# Altium project PDB_Board.PrjPcb
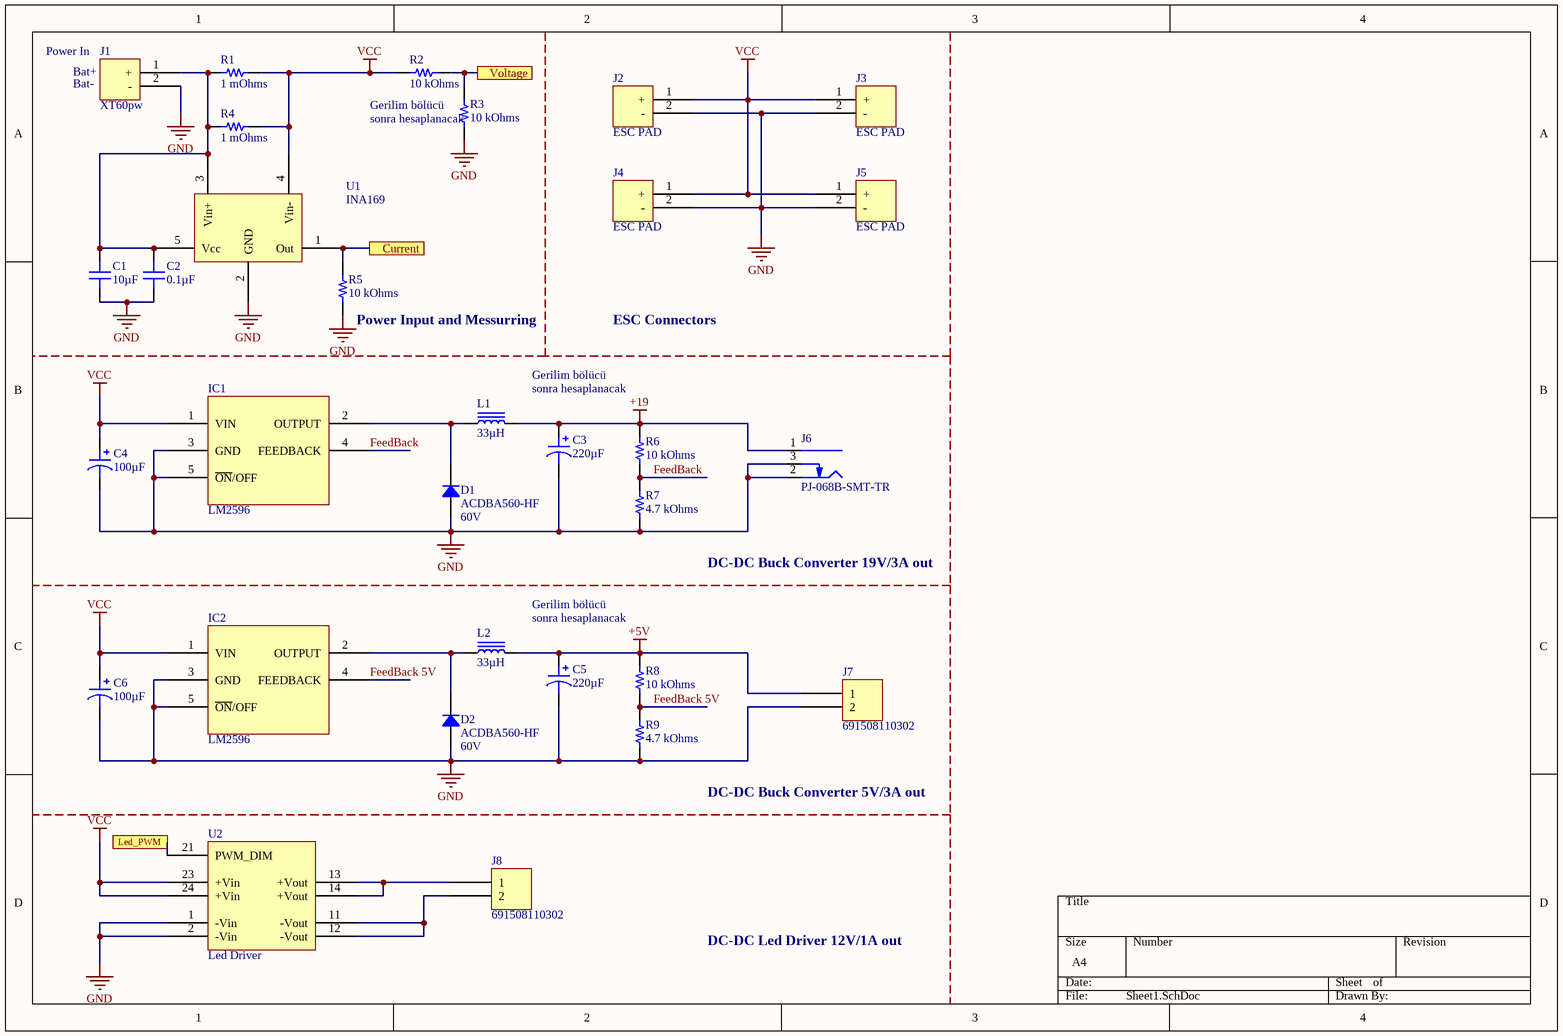
[diagram p0: Sheet1.SchDoc]
1 sheet, 31 parts. Net scope: flat (ports and power ports of the same name join across sheets).
Board files: PCB1.PcbDoc, PCB_ALTIGEN.PcbDoc

## Sheet Sheet1.SchDoc
size A4

### Parts
C1  10µF  [CAP 0603_1608]
C2  0.1µF  [CAP 0603_1608]
C3  220µF  [CAP ALSMD 8.3MM H10.5MM]
C4  100µF  [CAP ALSMD 8.3MM H10.5MM]
C5  220µF  [CAP ALSMD 8.3MM H10.5MM]
C6  100µF  [CAP ALSMD 8.3MM H10.5MM]
D1  ACDBA560-HF  Voltage - DC Reverse (Vr) (Max): 60V  [DO214AC SMA]
D2  ACDBA560-HF  Voltage - DC Reverse (Vr) (Max): 60V  [DO214AC SMA]
IC1  LM2596  [D2PAK]
IC2  LM2596  [D2PAK]
J1  XT60pw  [XT60_90degree]
J2  ESC PAD  [ESC Connector]
J3  ESC PAD  [ESC Connector]
J4  ESC PAD  [ESC Connector]
J5  ESC PAD  [ESC Connector]
J6  PJ-068B-SMT-TR  [CUI PJ-068B-SMT]
J7  691508110302  [WURTH 691508110302]
J8  691508110302  [WURTH 691508110302]
L1  33µH  [BOURNS SRR1280]
L2  33µH  [BOURNS SRR1280]
R1  1 mOhms  [VISHAY WSHP2818]
R2  10 kOhms  [RES 0603_1608]
R3  10 kOhms  [RES 0603_1608]
R4  1 mOhms  [VISHAY WSHP2818]
R5  10 kOhms  [RES 0603_1608]
R6  10 kOhms  [RES 0805_2012]
R7  4.7 kOhms  [RES 0805_2012]
R8  10 kOhms  [RES 0805_2012]
R9  4.7 kOhms  [RES 0805_2012]
U1  INA169  [INA169]
U2  Led Driver  [LDD100l]

### Ports
Current, Led_PWM, Voltage

### Nets
+5V: C5.1 J7.1 L2.2 R8.2
+19: C3.1 J6.1(Centre) L1.2 R6.2
GND: C1.1 C2.1 C3.2 C4.2 C5.2 C6.2 D1.1 D2.1 IC1.3(GND) IC1.5(~{ON}/OFF) IC2.3(GND) IC2.5(~{ON}/OFF) J1.2(-) J2.2(-) J3.2(-) J4.2(-) J5.2(-) J6.2(Outer) J6.3(SW) J7.2 R3.1 R5.1 R7.1 R9.1 U1.2(GND) U2.1(-Vin) U2.2(-Vin)
VCC: C4.1 C6.1 IC1.1(VIN) IC2.1(VIN) J2.1(+) J3.1(+) J4.1(+) J5.1(+) R1.2 R2.2 R4.2 U1.4(Vin-) U2.23(+Vin) U2.24(+Vin)
FeedBack: IC1.4(FEEDBACK) R6.1 R7.2
FeedBack 5V: IC2.4(FEEDBACK) R8.1 R9.2
NetC1_2: C1.2 C2.2 J1.1(+) R1.1 R4.1 U1.3(Vin+) U1.5(Vcc)
NetD1_2: D1.2 IC1.2(OUTPUT) L1.1
NetD2_2: D2.2 IC2.2(OUTPUT) L2.1
NetJ8_1: J8.1 U2.13(+Vout) U2.14(+Vout)
NetJ8_2: J8.2 U2.11(-Vout) U2.12(-Vout)
NetR2_1: R2.1 R3.2 ; port Voltage
NetR5_2: R5.2 U1.1(Out) ; port Current
NetU2_21: U2.21(PWM_DIM) ; port Led_PWM

### Notes on the sheet
- (near J1) Power In
- (near J1) Bat+
- (near J1) Bat-
- (near R3) Gerilim bölücü
- (near R3) sonra hesaplanacak
- (near R5) Power Input and Messurring
- Gerilim bölücü
- ESC Connectors
- sonra hesaplanacak
- DC-DC Buck Converter 19V/3A out
- DC-DC Buck Converter 5V/3A out
- DC-DC Led Driver 12V/1A out

### Library data of the parts
C1 = GRM188R6YA106MA73D: CAP CER 10UF 35V X5R 0603; Manufacturer: Murata Electronics; Tolerance: ±20%; Part Number: GRM188R6YA106MA73D; Value: 10µF; Applications: General Purpose; Capacitance: 10µF; ComponentLink1Description: Datasheet; ComponentLink1URL: https://www.murata.com/~/media/webrenewal/support/library/catalog/products/capacitor/mlcc/c02e.ashx?la=en-us; ComponentLink2Description: DigiKey Link; ComponentLink2URL: http://digikey.com/product-detail/en/murata-electronics/GRM188R6YA106MA73D/490-13248-1-ND/5877456; Device Package: 0603 (1608 Metric); LastUpdated: 2.09.2020 01:03:25; Lifecycle Status: Active; Minimum Order: 1; Mounting Type: Surface Mount, MLCC; Operating Temperature: -55°C ~ 85°C; Package / Case: 0603 (1608 Metric); Packaging: TapeAndReel; PartId: 8560; Part Status: Active; Price: 0.09; Series: GRM; Size / Dimension: 0.063" L x 0.031" W (1.60mm x 0.80mm); Supplier 1: DigiKey; Supplier Part Number 1: 490-13248-1-ND; Temperature Coefficient: X5R; Thickness (Max): 0.039" (1.00mm); Voltage - Rated: 35V
C2 = GMK107BJ104KAHT: CAP CER 0.1UF 35V X5R 0603; Manufacturer: Taiyo Yuden; Tolerance: ±10%; Part Number: GMK107BJ104KAHT; Value: 0.1µF; Applications: Automotive; Capacitance: 0.1µF; ComponentLink1Description: Datasheet; ComponentLink1URL: https://ds.yuden.co.jp/TYCOMPAS/ut/detail?pn=GMK107BJ104KAHT  &u=M; ComponentLink2Description: DigiKey Link; ComponentLink2URL: http://digikey.com/product-detail/en/taiyo-yuden/GMK107BJ104KAHT/587-3357-1-ND/4157244; Device Package: 0603 (1608 Metric); LastUpdated: 2.09.2020 01:03:32; Lifecycle Status: Active; Minimum Order: 1; Mounting Type: Surface Mount, MLCC; Operating Temperature: -55°C ~ 85°C; Package / Case: 0603 (1608 Metric); Packaging: TapeAndReel; PartId: 4191; Part Status: Active; Price: 0.02; Ratings: AEC-Q200; Series: M; Size / Dimension: 0.063" L x 0.031" W (1.60mm x 0.80mm); Supplier 1: DigiKey; Supplier Part Number 1: 587-3357-1-ND; Temperature Coefficient: X5R; Thickness (Max): 0.035" (0.90mm); Voltage - Rated: 35V
C3 C5 = EEE-FK1V221GP: CAP ALUM 220UF 20% 35V SMD; Manufacturer: Panasonic Electronic Components; Impedance: 160 mOhms; Lifetime @ Temp.: 5000 Hrs @ 105°C; Polarization: Polar; Ripple Current @ High Frequency: 600mA @ 100kHz; Ripple Current @ Low Frequency: 450mA @ 120Hz; Surface Mount Land Size: 0.327" L x 0.327" W (8.30mm x 8.30mm); Part Number: EEE-FK1V221GP; Applications: Automotive; Capacitance: 220µF; ComponentLink1Description: Datasheet; ComponentLink1URL: http://industrial.panasonic.com/www-cgi/jvcr13pz.cgi?E+PZ+4+ABA0120+EEEFK1V221GP+8+WW; ComponentLink2Description: DigiKey Link; ComponentLink2URL: http://digikey.com/product-detail/en/panasonic-electronic-components/EEE-FK1V221GP/PCE4321CT-ND/1014320; Device Package: Radial, Can - SMD; Height - Seated (Max): 0.413" (10.50mm); LastUpdated: 2.09.2020 01:25:16; Lifecycle Status: Active; Minimum Order: 1; Mounting Type: Surface Mount; Operating Temperature: -55°C ~ 105°C; Package / Case: Radial, Can - SMD; Packaging: TapeAndReel; PartId: 7494; Part Status: Active; Price: 0.33; Ratings: AEC-Q200; Series: FK; Size / Dimension: 0.315" Dia (8.00mm); Supplier 1: DigiKey; Supplier Part Number 1: PCE4321CT-ND; Tolerance: ±20%; Value: 220µF; Voltage - Rated: 35V
C4 C6 = UCD1V101MNL1GS: CAP ALUM 100UF 20% 35V SMD; Manufacturer: Nichicon; Impedance: 160 mOhms; Lifetime @ Temp.: 5000 Hrs @ 105°C; Polarization: Polar; Ripple Current @ High Frequency: 600mA @ 100kHz; Ripple Current @ Low Frequency: 300mA @ 120Hz; Surface Mount Land Size: 0.327" L x 0.327" W (8.30mm x 8.30mm); Part Number: UCD1V101MNL1GS; Applications: Automotive; Capacitance: 100µF; ComponentLink1Description: Datasheet; ComponentLink1URL: http://nichicon-us.com/english/products/pdfs/e-ucd.pdf; ComponentLink2Description: DigiKey Link; ComponentLink2URL: http://digikey.com/product-detail/en/nichicon/UCD1V101MNL1GS/493-6186-1-ND/3438699; Device Package: Radial, Can - SMD; Height - Seated (Max): 0.413" (10.50mm); LastUpdated: 2.09.2020 01:25:16; Lifecycle Status: Active; Minimum Order: 1; Mounting Type: Surface Mount; Operating Temperature: -55°C ~ 105°C; Package / Case: Radial, Can - SMD; Packaging: TapeAndReel; PartId: 7455; Part Status: Active; Price: 0.19; Ratings: AEC-Q200; Series: UCD; Size / Dimension: 0.315" Dia (8.00mm); Supplier 1: DigiKey; Supplier Part Number 1: 493-6186-1-ND; Tolerance: ±20%; Value: 100µF; Voltage - Rated: 35V
D1 D2 = ACDBA560-HF: DIODE SCHOTTKY 60V 5A DO214AC; Manufacturer: Comchip Technology; Capacitance @ Vr, F: 250pF @ 4V, 1MHz; Current - Average Rectified (Io): 5A (DC); Current - Reverse Leakage @ Vr: 500µA @ 60V; Speed: Fast Recovery =< 500ns, > 200mA (Io); Voltage - Forward (Vf) (Max) @ If: 700mV @ 5A; Part Number: ACDBA560-HF; ComponentLink1Description: Datasheet; ComponentLink1URL: http://www.comchiptech.com/admin/files/product/ACDBA560-HF%20RevA201382.pdf; ComponentLink2Description: DigiKey Link; ComponentLink2URL: http://digikey.com/product-detail/en/comchip-technology/ACDBA560-HF/641-2078-1-ND/10131664; Diode Type: Schottky; LastUpdated: 2.09.2020 01:19:04; Lifecycle Status: Active; Minimum Order: 1; Mounting Type: Surface Mount; Operating Temperature - Junction: -55°C ~ 125°C; Package / Case: DO-214AC, SMA; Packaging: TapeAndReel; PartId: 1832; Part Status: Active; Price: 0.13; Series: Automotive, AEC-Q101; Supplier 1: DigiKey; Supplier Part Number 1: 641-2078-1-ND; Supplier Device Package: DO-214AC (SMA)
J1 = XT60PW-M: xt60 90 degree Connector
J2-J5 = ESC Connector
J6 = PJ-068B-SMT-TR: CONN PWR JACK 2.5X5.5MM SOLDER; Manufacturer: CUI Devices; Actual Diameter: 0.098" (2.50mm ID), 0.232" (5.90mm OD); Current Rating (Amps): 5A; Gender: Male; Industry Recognized Mating Diameter: 2.50mm ID (0.098"), 5.50mm OD (0.217"); Internal Switch(s): Single Switch, Normally Closed; Material Flammability Rating: UL94 V-0; Mating Length/Depth: 0.323" (8.20mm); Number of Positions/Contacts: 2 Conductors, 3 Contacts; Shielding: Shielded; Voltage - Rated: 24VDC; Part Number: PJ-068B-SMT-TR; ComponentLink1Description: Datasheet; ComponentLink1URL: https://www.cuidevices.com/product/resource/digikeypdf/pj-068b-smt-tr.pdf; ComponentLink2Description: DigiKey Link; ComponentLink2URL: //digikey.com/product-detail/en/cui-devices/PJ-068B-SMT-TR/CP-068BPJTR-ND/2625163; Connector Type: Jack; Features: Board Guide; LastUpdated: 16.12.2019 18:57:10; Lifecycle Status: 0; Minimum Order: 1; Mounting Type: Surface Mount, Right Angle; Packaging: TapeAndReel; Part Status: Active; Price: 1.38; Series: -; Supplier 1: DigiKey; Supplier Part Number 1: CP-068BPJTR-ND; Termination: Solder
J7 J8 = 691508110302: TERM BLOCK 2POS 3.5MM SMD; Manufacturer: Würth Elektronik; Current: 10A; Mating Orientation: Horizontal and Vertical with Board; Number of Levels: 1; Pitch: 0.138" (3.50mm); Positions Per Level: 2; Voltage: 300V; Wire Gauge: 16-30 AWG; Wire Termination: Screw - Rising Cage Clamp; Part Number: 691508110302; Color: Black; ComponentLink1Description: Datasheet; ComponentLink1URL: https://katalog.we-online.de/em/datasheet/6915081103xx.pdf; ComponentLink2Description: DigiKey Link; ComponentLink2URL: http://digikey.com/product-detail/en/w-rth-elektronik/691508110302/732-5963-1-ND/5047612; Features: Board Guide, Mounting Flange; LastUpdated: 15.01.2020 04:18:55; Lifecycle Status: Active; Minimum Order: 1; Mounting Type: Surface Mount; Packaging: TapeAndReel; Part Status: Active; Price: 1.57; Series: WR-TBL Series 5081; Supplier 1: DigiKey; Supplier Part Number 1: 732-5963-1-ND
L1 L2 = SRR1280-330M: FIXED IND 33UH 3.5A 57 MOHM SMD; Manufacturer: Bourns Inc.; Current - Saturation: 3.3A; DC Resistance (DCR): 57mOhm Max; Frequency - Self Resonant: 9.5MHz; Inductance Frequency - Test: 100kHz; Material - Core: Ferrite; Q @ Freq: 28 @ 2.52MHz; Shielding: Shielded; Tolerance: ±20%; Type: Wirewound; Part Number: SRR1280-330M; ComponentLink1Description: Datasheet; ComponentLink1URL: https://www.bourns.com/docs/Product-Datasheets/SRR1280.pdf; ComponentLink2Description: DigiKey Link; ComponentLink2URL: http://digikey.com/product-detail/en/bourns-inc/SRR1280-330M/SRR1280-330MCT-ND/2127440; Current Rating (Amps): 3.5A; Device Package: Nonstandard; Height - Seated (Max): 0.315" (8.00mm); Inductance: 33µH; LastUpdated: 2.09.2020 01:22:09; Lifecycle Status: Active; Minimum Order: 1; Mounting Type: Surface Mount; Operating Temperature: -40°C ~ 125°C; Package / Case: Nonstandard; Packaging: TapeAndReel; PartId: 25; Part Status: Active; Price: 0.65; Series: SRR1280; Size / Dimension: 0.492" L x 0.492" W (12.50mm x 12.50mm); Supplier 1: DigiKey; Supplier Part Number 1: SRR1280-330MCT-ND; Value: 33µH
R1 R4 = WSHP28181L000FEA: RES 0.001 OHM 1% 10W 2818; Manufacturer: Vishay Dale; Temperature Coefficient: ±200ppm/°C; Part Number: WSHP28181L000FEA; Package / Case: Nonstandard; ComponentLink1Description: Datasheet; ComponentLink1URL: http://www.vishay.com/docs/30347/wshp2818.pdf; ComponentLink2Description: DigiKey Link; ComponentLink2URL: http://digikey.com/product-detail/en/vishay-dale/WSHP28181L000FEA/541-3272-1-ND/6605248; Composition: Metal Element; Device Package: Nonstandard; Features: Automotive AEC-Q200, Current Sense, Moisture Resistant, Pulse Withstanding; Height - Seated (Max): 0.069" (1.75mm); LastUpdated: 2.09.2020 01:27:09; Lifecycle Status: Active; Minimum Order: 1; Number of Terminations: 2; Operating Temperature: -65°C ~ 170°C; Packaging: TapeAndReel; PartId: 2682; Part Status: Active; Power (Watts): 10W; Price: 0.90; Ratings: AEC-Q200; Resistance: 1 mOhms; Series: WSHP2818; Size / Dimension: 0.280" L x 0.181" W (7.10mm x 4.60mm); Supplier 1: DigiKey; Supplier Part Number 1: 541-3272-1-ND; Supplier Device Package: 2818; Tolerance: ±1%; Value: 1 mOhms
R2 R3 R5 = RNCS0603BKE10K0: RES 10K OHM 0.1% 1/16W 0603; Manufacturer: Stackpole Electronics Inc; Power (Watts): 0.063W, 1/16W; Temperature Coefficient: ±25ppm/°C; Part Number: RNCS0603BKE10K0; Value: 10 kOhms; ComponentLink1Description: Datasheet; ComponentLink1URL: https://www.seielect.com/catalog/sei-rncs_rnch.pdf; ComponentLink2Description: DigiKey Link; ComponentLink2URL: http://digikey.com/product-detail/en/stackpole-electronics-inc/RNCS0603BKE10K0/RNCS0603BKE10K0CT-ND/1800113; Composition: Thin Film; Device Package: 0603 (1608 Metric); Features: Anti-Corrosive, Automotive AEC-Q200, Moisture Resistant; Height - Seated (Max): 0.022" (0.55mm); LastUpdated: 2.09.2020 01:10:25; Lifecycle Status: Active; Minimum Order: 1; Number of Terminations: 2; Operating Temperature: -55°C ~ 155°C; Package / Case: 0603 (1608 Metric); Packaging: TapeAndReel; PartId: 4838; Part Status: Active; Price: 0.08; Ratings: AEC-Q200; Resistance: 10 kOhms; Series: RNCS; Size / Dimension: 0.061" L x 0.031" W (1.55mm x 0.80mm); Supplier 1: DigiKey; Supplier Part Number 1: RNCS0603BKE10K0CT-ND; Supplier Device Package: 0603; Tolerance: ±0.1%
R6 R8 = RNCP0805FTD10K0: RES 10K OHM 1% 1/4W 0805; Manufacturer: Stackpole Electronics Inc; Power (Watts): 0.25W, 1/4W; Temperature Coefficient: ±100ppm/°C; Part Number: RNCP0805FTD10K0; Value: 10 kOhms; ComponentLink1Description: Datasheet; ComponentLink1URL: https://www.seielect.com/catalog/sei-rncp.pdf; ComponentLink2Description: DigiKey Link; ComponentLink2URL: http://digikey.com/product-detail/en/stackpole-electronics-inc/RNCP0805FTD10K0/RNCP0805FTD10K0CT-ND/2240601; Composition: Thin Film; Device Package: 0805 (2012 Metric); Features: Anti-Sulfur, Moisture Resistant; Height - Seated (Max): 0.024" (0.60mm); LastUpdated: 2.09.2020 01:15:23; Lifecycle Status: Active; Minimum Order: 1; Number of Terminations: 2; Operating Temperature: -55°C ~ 155°C; Package / Case: 0805 (2012 Metric); Packaging: TapeAndReel; PartId: 28021; Part Status: Active; Price: 0.01; Resistance: 10 kOhms; Series: RNCP; Size / Dimension: 0.079" L x 0.049" W (2.00mm x 1.25mm); Supplier 1: DigiKey; Supplier Part Number 1: RNCP0805FTD10K0CT-ND; Supplier Device Package: 0805; Tolerance: ±1%
R7 R9 = CRGP0805F4K7: CRGP 0805 4K7 1%; Manufacturer: TE Connectivity Passive Product; Power (Watts): 0.333W, 1/3W; Temperature Coefficient: ±100ppm/°C; Part Number: CRGP0805F4K7; Value: 4.7 kOhms; ComponentLink1Description: Datasheet; ComponentLink1URL: https://www.te.com/commerce/DocumentDelivery/DDEController?Action=srchrtrv&DocNm=9-1773463-9&DocType=DS&DocLang=English; ComponentLink2Description: DigiKey Link; ComponentLink2URL: http://digikey.com/product-detail/en/te-connectivity-passive-product/CRGP0805F4K7/A130485CT-ND/8578317; Composition: Thick Film; Device Package: 0805 (2012 Metric); Features: Pulse Withstanding; Height - Seated (Max): 0.026" (0.65mm); LastUpdated: 2.09.2020 01:15:22; Lifecycle Status: Active; Minimum Order: 1; Number of Terminations: 2; Operating Temperature: -55°C ~ 155°C; Package / Case: 0805 (2012 Metric); Packaging: TapeAndReel; PartId: 28726; Part Status: Active; Price: 0.02; Resistance: 4.7 kOhms; Series: CRGP; Size / Dimension: 0.079" L x 0.049" W (2.00mm x 1.25mm); Supplier 1: DigiKey; Supplier Part Number 1: A130485CT-ND; Supplier Device Package: 0805; Tolerance: ±1%
U1 = INA169: Current sensing IC
U2 = LDD1000L: LDD 1000L 12V 1A; ComponentLink1Description: New link; ComponentLink1URL: https://www.meanwell-web.com/en-gb/dc-dc-step-down-led-driver-constant-current-cc-ldd--1000l